# EAGLE design battery_brick_2.12 (EAGLE 7.2.0)
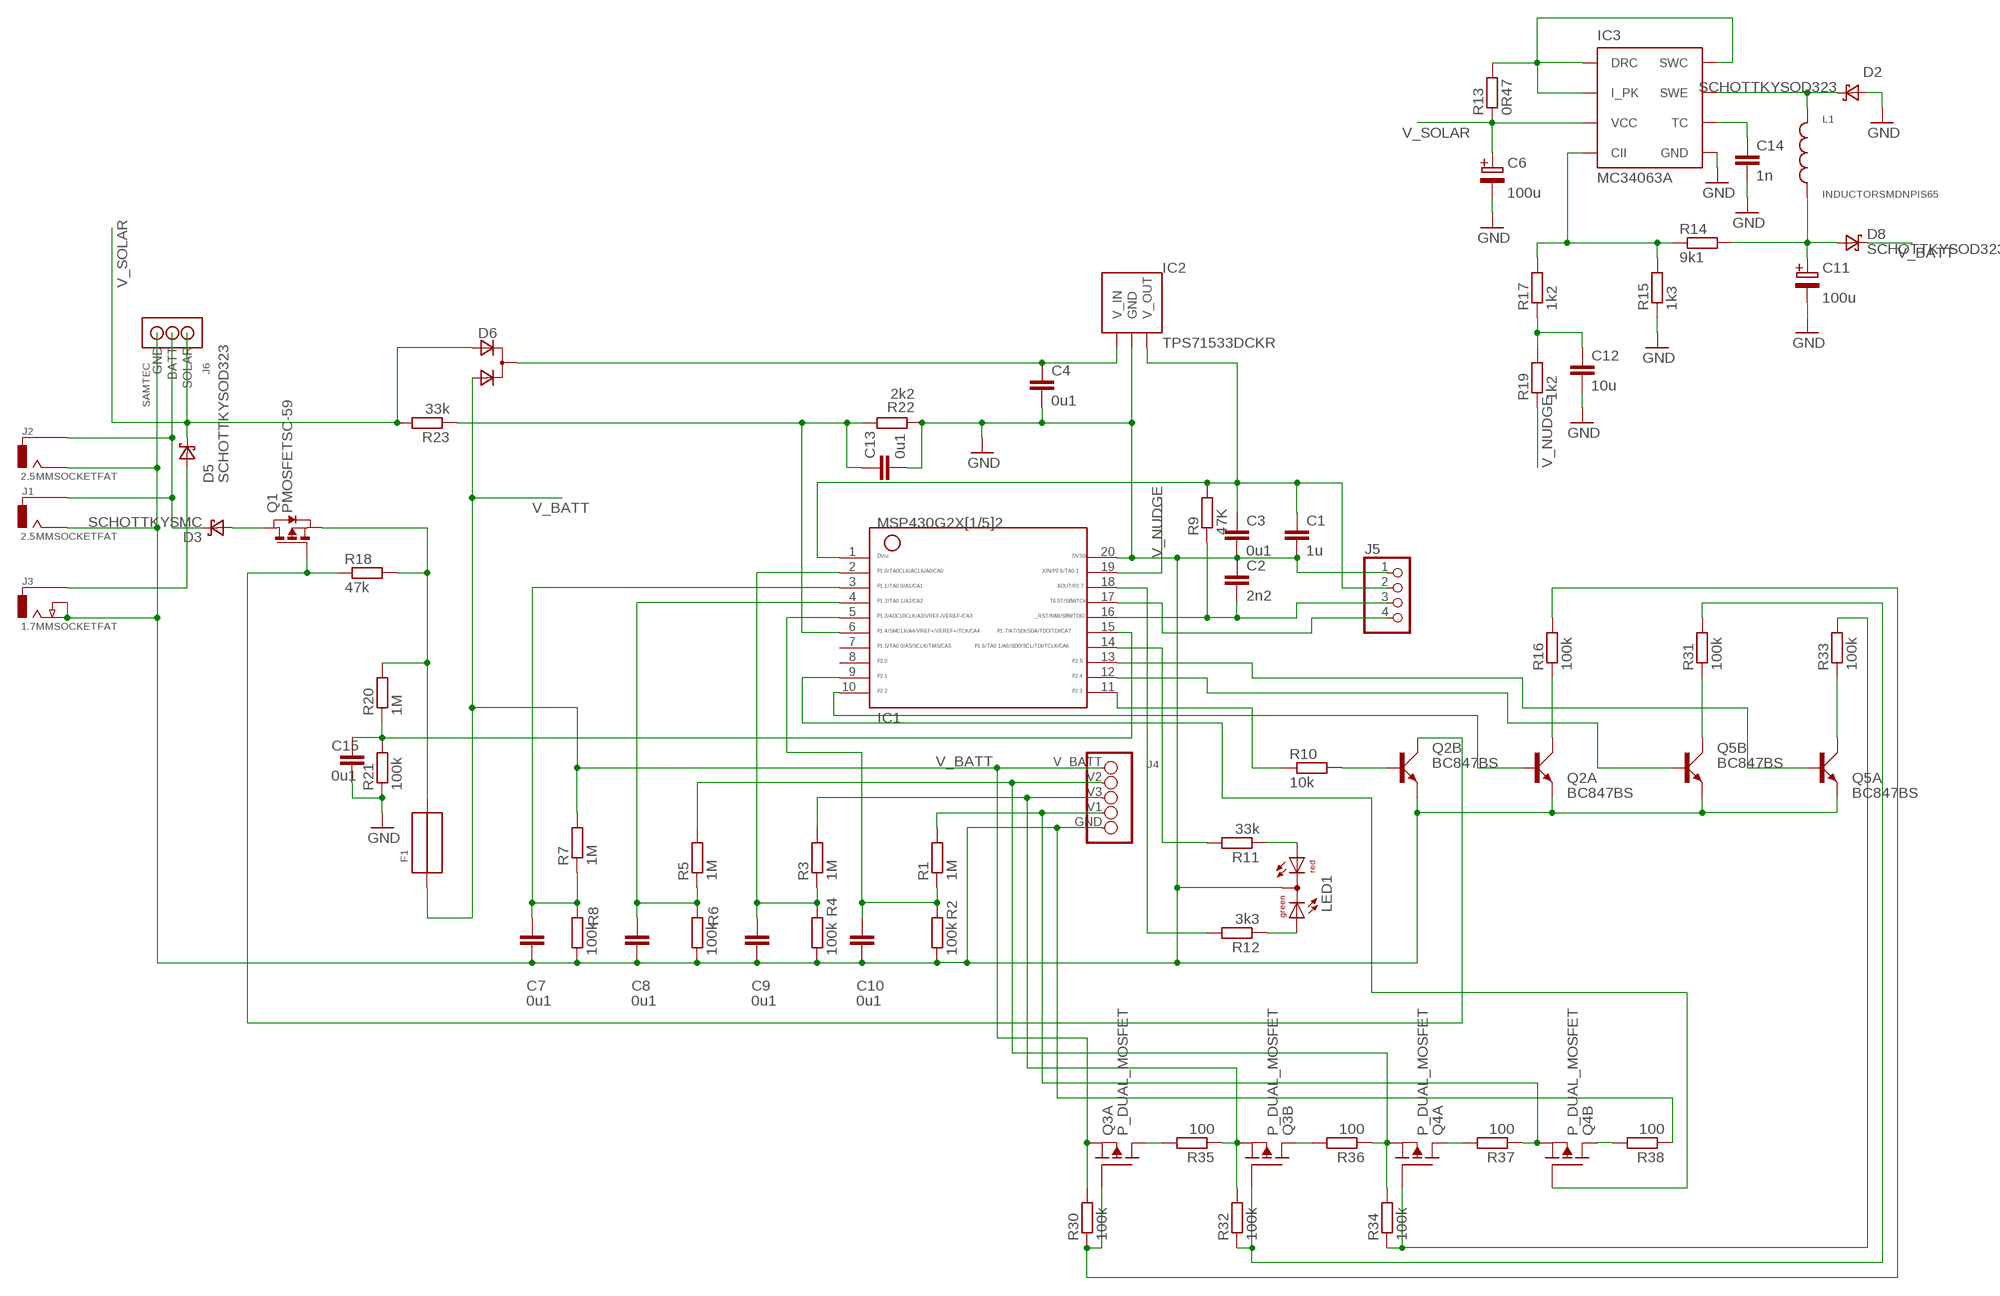
[diagram p0: schematic, sheet 1]

## Parts
C1  1u  C-EUC0603K  [C0603K]
C2  2n2  C-EUC0603K  [C0603K]
C3  0u1  C-EUC0603K  [C0603K]
C4  0u1  C-EUC0603  [C0603]
C6  100u  ELEC_CAP_CAN6VZH101  [CAPCANVZH101]
C7  0u1  C-EUC0603  [C0603]
C8  0u1  C-EUC0603  [C0603]
C9  0u1  C-EUC0603  [C0603]
C10  0u1  C-EUC0603  [C0603]
C11  100u  ELEC_CAP_CAN6VZH101  [CAPCANVZH101]
C12  10u  C-EUC2012  [C2012]
C13  0u1  C-EUC0603  [C0603]
C14  1n  C-EUC0603  [C0603]
C15  0u1  C-EUC0603  [C0603]
D2  SCHOTTKYSOD323  [SOD323]
D3  SCHOTTKYSMC  [SMC]
D5  SCHOTTKYSOD323  [SOD323]
D6  D_2ASOT323  [SOT323]
D8  SCHOTTKYSOD323  [SOD323]
F1  FUSE  [1812]
IC1  G2X[1/5]2---PW20  [PW20]
IC2  TPS71533DCKR  [SC70-5]
IC3  MC34063A  [SOIC8]
J1  2.5MMSOCKETFAT  [2.5MMSOCKET-OBLONGFAT]
J2  2.5MMSOCKETFAT  [2.5MMSOCKET-OBLONGFAT]
J3  1.7MMSOCKETFAT  [1.7MMSOCKET-OBLONGFAT]
J4  S5B-PH-K-S  [S5B-PH-K-S]
J5  PINHD-1X4  [1X04]
J6  SAMTEC  [SAMTEC]
L1  INDUCTORSMDNPIS65  [INDUCTOR_NPIS65]
LED1  DUOLED5MM  [DUOLED5MM]
Q1  PMOSFETSC-59  [SC-59]
Q2  BC847BS  [SOT363_PHILIPS]
Q3  P_DUAL_MOSFET  [SOT666]
Q4  P_DUAL_MOSFET  [SOT666]
Q5  BC847BS  [SOT363_PHILIPS]
R1  1M  R-EU_R0805  [R0805]
R2  100k  R-EU_R0805  [R0805]
R3  1M  R-EU_R0805  [R0805]
R4  100k  R-EU_R0805  [R0805]
R5  1M  R-EU_R0805  [R0805]
R6  100k  R-EU_R0805  [R0805]
R7  1M  R-EU_R0805  [R0805]
R8  100k  R-EU_R0805  [R0805]
R9  47K  R-EU_R0603  [R0603]
R10  10k  R-EU_R0603  [R0603]
R11  33k  R-EU_R0603  [R0603]
R12  3k3  R-EU_R0603  [R0603]
R13  0R47  R-EU_R1206  [R1206]
R14  9k1  R-EU_R0603  [R0603]
R15  1k3  R-EU_R0603  [R0603]
R16  100k  R-EU_R0603  [R0603]
R17  1k2  R-EU_R0603  [R0603]
R18  47k  R-EU_R0603  [R0603]
R19  1k2  R-EU_R0603  [R0603]
R20  1M  R-EU_R0603  [R0603]
R21  100k  R-EU_R0603  [R0603]
R22  2k2  R-EU_R0603  [R0603]
R23  33k  R-EU_R0603  [R0603]
R30  100k  R-EU_R0603  [R0603]
R31  100k  R-EU_R0603  [R0603]
R32  100k  R-EU_R0603  [R0603]
R33  100k  R-EU_R0603  [R0603]
R34  100k  R-EU_R0603  [R0603]
R35  100  R-EU_M1206  [M1206]
R36  100  R-EU_M1206  [M1206]
R37  100  R-EU_M1206  [M1206]
R38  100  R-EU_M1206  [M1206]

## Nets
GND: C1.2 C2.1 C3.2 C4.2 C6.-VE C7.2 C8.2 C9.2 C10.2 C11.-VE C12.2 C13.2 C14.2 C15.2 D2.ANODE IC1.20 IC2.GND IC3.GND J1.-VE J2.-VE J3.-VE J3.P$3 J4.GND J5.1 J6.GND LED1.K(C) Q2.1(A:E) Q2.4(B:E) Q5.1(A:E) Q5.4(B:E) R2.1 R4.1 R6.1 R8.1 R15.1 R21.1 R22.1 R38.1
N$1: IC1.17 J5.4
N$2: C10.1 IC1.5 R1.1 R2.2
N$3: F1.2 Q1.S R18.2 R20.2
N$4: C9.1 IC1.2 R3.1 R4.2
N$5: D3.CATHODE J1.+VE J2.+VE J6.BATT
N$6: C8.1 IC1.4 R5.1 R6.2
N$7: C7.1 IC1.3 R7.1 R8.2
N$8: C15.1 IC1.15 R20.1 R21.2
N$9: Q2.5(B:B) R10.2
N$10: IC1.14 R11.2
N$11: J4.V1 Q4.4(B:S) R1.2 R37.1
N$12: D5.ANODE J3.+VE
N$13: LED1.AG R12.1
N$14: LED1.AR R11.1
N$15: J4.V3 Q3.4(B:S) R3.2 R32.2 R35.1
N$16: J4.V2 Q4.1(A:S) R5.2 R34.2 R36.1
N$17: IC3.DRC IC3.I_PK IC3.SWC R13.2
N$19: D3.ANODE Q1.D
N$20: Q1.G Q2.3(B:C) R18.1
N$21: IC1.18 R12.2
N$22: IC3.CII R14.1 R15.2 R17.2
N$23: D2.CATHODE IC3.SWE L1.P$1
N$24: C13.1 IC1.6 R22.2 R23.1
N$25: C12.1 R17.1 R19.2
N$29: C11.+VE(P$1+) D8.ANODE L1.P$2 R14.2
N$30: C14.1 IC3.TC
N$32: Q3.6(A:D) R35.2
N$34: Q5.3(B:C) R31.1
N$38: IC1.9 Q4.5(B:G)
N$40: C2.2 IC1.16 J5.3 R9.1
N$44: Q3.2(A:G) R16.2 R30.1
N$45: Q3.5(B:G) R31.2 R32.1
N$48: Q4.2(A:G) R33.2 R34.1
N$49: Q5.6(A:C) R33.1
N$50: Q2.6(A:C) R16.1
N$51: Q4.3(B:D) R38.2
N$52: IC1.11 R10.1
N$53: IC1.10 Q2.2(A:B)
N$54: IC1.12 Q5.5(B:B)
N$55: IC1.13 Q5.2(A:B)
N$56: Q3.3(B:D) R36.2
N$57: Q4.6(A:D) R37.2
V_BATT: D6.3(A2) D8.CATHODE F1.1 J4.V_BATT Q3.1(A:S) R7.2 R30.2
V_NUDGE: IC1.19 R19.1
V_REGIN: C4.1 D6.1(C) IC2.IN(V_IN)
V_SOLAR: C6.+VE(P$1+) D5.CATHODE D6.2(A1) IC3.VCC J6.SOLAR R13.1 R23.2
VCC: C1.1 C3.1 IC1.1 IC2.OUT(V_OUT) J5.2 R9.2
Unconnected: IC1.7 IC1.8

## Library data of the parts
C1-C4 C7-C10 C12-C15 = rcl:C-EU: CAPACITOR, European symbol
C6 C11 = mylib:ELEC_CAP_CAN6
D2 D5 D8 = mylib:SCHOTTKY: DIODE; OC_FARNELL: 8737991
D3 = mylib:SCHOTTKY: DIODE
D6 = zetex:D_2A: Dual DIODE; OC_FARNELL: unknown; OC_NEWARK: unknown
F1 = mylib:FUSE
IC1 = TI_MSP430_v16:G2X[1/5]2---PW20: MSP430G2X[1/5]2 MSP430G2x52, MSP430G2x12 TSSOP (PW) 20 Pin Package http://focus.ti.com/docs/prod/folders/print/msp430g2452.html
IC2 = mylib:TPS71533DCKR
IC3 = mylib:MC34063A; OC_FARNELL: 1053582
J1 J2 = mylib:2.5MMSOCKET
J3 = mylib:1.7MMSOCKET
J4 = mylib:S5B-PH-K-S
J5 = pinhead:PINHD-1X4: PIN HEADER
J6 = mylib:SAMTEC
L1 = mylib:INDUCTORSMD
LED1 = mylib:DUOLED5MM: DUO LED 2 colors, 5 mm, round
Q1 = mylib:PMOSFET: MOS FET
Q2 Q5 = transistor-small-signal:BC847BS: NPN general purpose double transistor Source: http://www.farnell.com/datasheets/2466.pdf
Q3 Q4 = mylib:P_DUAL_MOSFET: Dual N-Channel 30-V (D-S) MOSFET Source: http://www.vishay.com/docs/71053/71053.pdf
R1 R3 R5 R7 R9 R10 R13-R15 R17-R20 R35-R38 = rcl:R-EU_: RESISTOR, European symbol
R2 R4 R6 R8 R11 R12 R16 R21-R23 R30-R34 = resistor:R-EU_: RESISTOR, European symbol

## Board
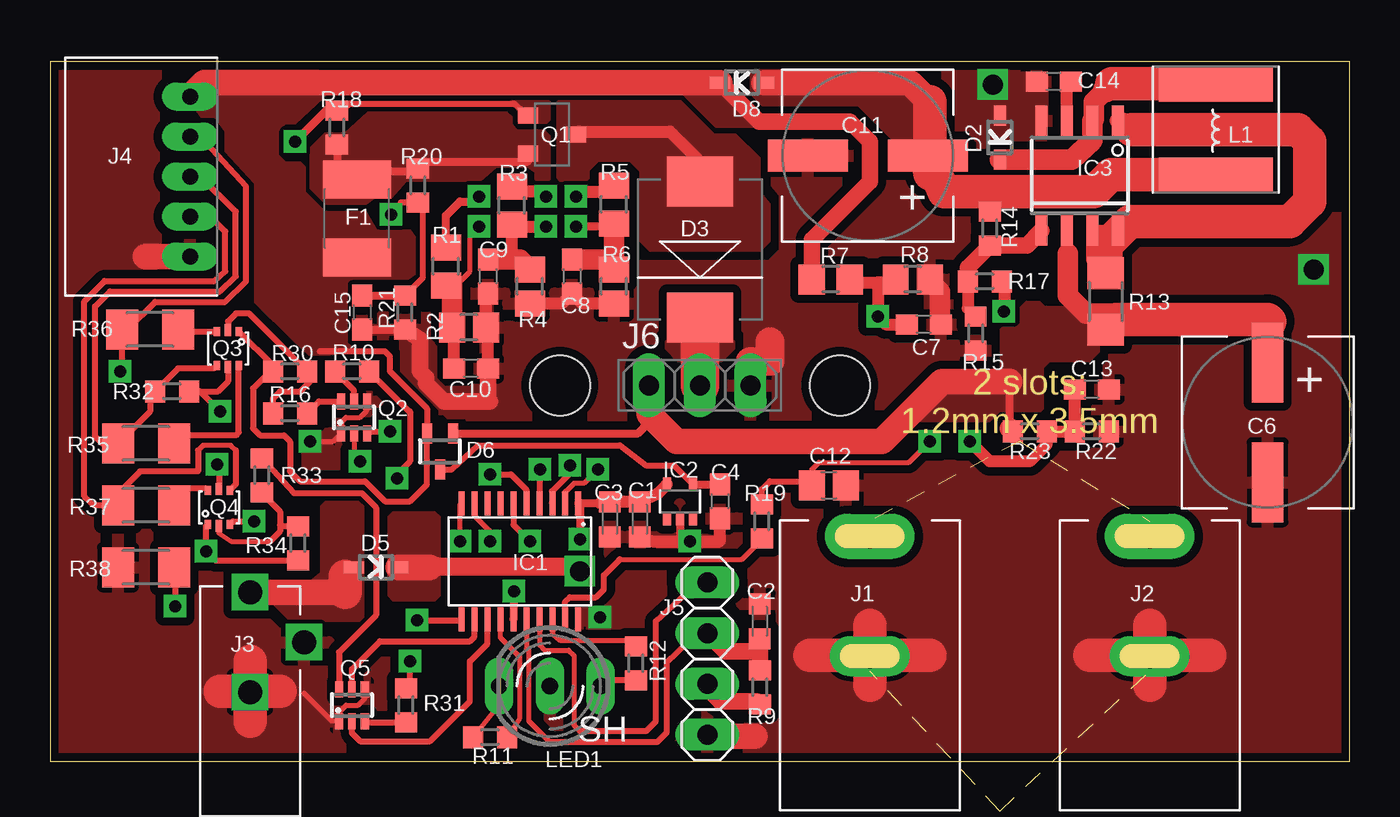
[diagram p1: board, top side]
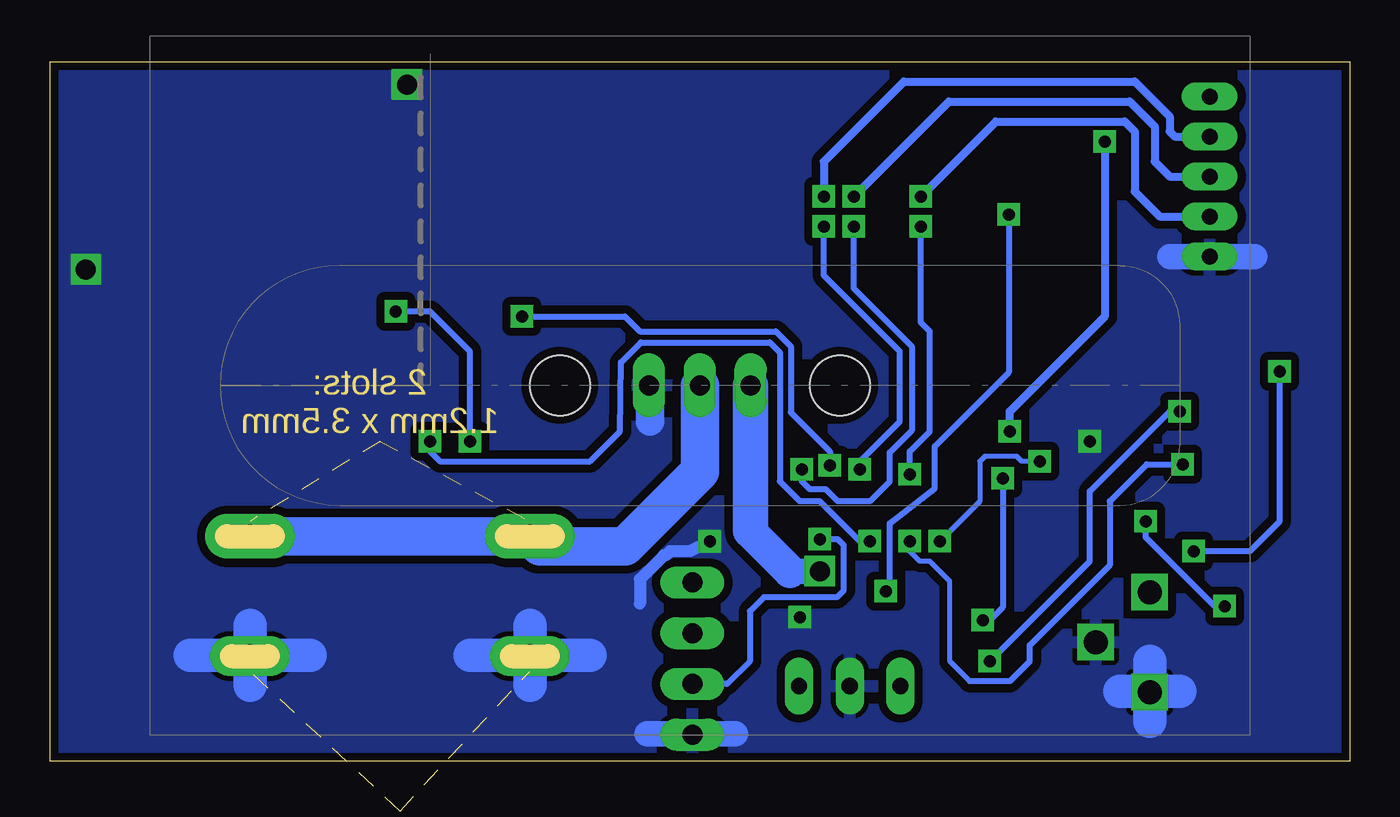
[diagram p2: board, bottom side, seen from below]

Size 65 x 35 mm. Coordinates in mm from the lower left corner, seen from the top.
Outline: 0,0 65,0 65,35 0,35 0,0
Copper layers (1*16): Top 0.035mm / dielectric 1.5mm / Bottom 0.035mm
Design rules "myRules": minimum track width 8mil, minimum drill 20mil, track to track 8mil, track to pad 8mil, pad to pad 9mil, via to via 8mil, smd to smd 8mil, copper to edge 10mil, drill to drill 8mil, minimum pad ring 12mil, minimum via ring 10mil, stop-mask expansion 3mil, vias tented up to drill 40mil, thermal gap 10mil
Holes 3 mm at 25.5,18.8 39.5,18.8
tKeepout: area 22.8,16.1 to 28.2,21.6; area 36.8,16.1 to 42.2,21.6
Milling: area 73.5,2.7 to 75,3.3; area 92,2.7 to 93.5,3.3; area 83.5,3.4 to 83.5,3.4; area 101.2,10 to 101.8,11.5; area 101.2,18.5 to 101.8,20; area 101.1,15 to 101.1,15; 34 lines

### Footprints (pad centres in the part's own frame; a part is rotated, then mirrored left to right if it is on the bottom)
C0603K = smd 1.05 x 1.08: 1 -0.875,0; 2 0.875,0
C0603 = smd 1.1 x 1: 1 -0.85,0; 2 0.85,0
CAPCANVZH101 = smd 1.6 x 4: +VE 0,3; -VE 0,-3
C2012 = smd 1.3 x 1.5: 1 -0.85,0; 2 0.85,0
SOD323 = smd 1 x 0.6: ANODE 1.1,0; CATHODE -1.1,0
SMC = smd 2.5 x 3.3: ANODE 0,0; CATHODE 6.8,0
SOT323 = smd 0.5 x 1: 1 0,0.9; 2 -0.65,-0.9; 3 0.65,-0.9
1812 = smd 1.9 x 3.4: 1 -1.95,0; 2 1.95,0
PW20 = smd 0.3 x 1.2: 1 -2.925,-2.9; 2 -2.275,-2.9; 3 -1.625,-2.9; 4 -0.975,-2.9; 5 -0.325,-2.9; 6 0.325,-2.9; 7 0.975,-2.9; 8 1.625,-2.9; 9 2.275,-2.9; 10 2.925,-2.9; 11 2.925,2.9; 12 2.275,2.9; 13 1.625,2.9; 14 0.975,2.9; 15 0.325,2.9; 16 -0.325,2.9; 17 -0.975,2.9; 18 -1.625,2.9; 19 -2.275,2.9; 20 -2.925,2.9
SC70-5 = smd 0.4 x 0.7: FB/NC -0.65,-0.85; GND 0,-0.85; IN 0.65,0.85; NC 0.65,-0.85; OUT -0.65,0.85
SOIC8 = smd 1.5 x 0.6: CII 0.21,-1.905; DRC 0.21,1.905; GND -5.29,-1.905; I_PK 0.21,0.635; SWC -5.29,1.905; SWE -5.29,0.635; TC -5.29,-0.635; VCC 0.21,-0.635
2.5MMSOCKET-OBLONGFAT = drill 1.2 pad 2.25 long: +VE 0,0 | drill 1.2 pad 2 long: -VE 0,-6
1.7MMSOCKET-OBLONGFAT = drill 1.2 square: +VE 0,0; -VE 0,-5; P$3 2.7,-2.5
S5B-PH-K-S = drill 0.8 long: GND 0,0; V1 0,2; V2 0,6; V3 0,4; V_BATT 0,8
1X04 = drill 1 long: 1 -3.81,0; 2 -1.27,0; 3 1.27,0; 4 3.81,0
SAMTEC = drill 1 long: BATT 0,0; GND 2.54,0; SOLAR -2.54,0
INDUCTOR_NPIS65 = smd 5.7 x 1.7: P$1 0,2.25; P$2 0,-2.25
DUOLED5MM = drill 0.813 long: AG -2.54,0; AR 2.54,0; K 0,0
SC-59 = smd 0.8 x 1: D 0.95,2.4; G 0,0; S 1.9,0
SOT363_PHILIPS = smd 0.4 x 0.8: 1 -0.65,-0.8; 2 0,-0.8; 3 0.65,-0.8; 4 0.65,0.8; 5 0,0.8; 6 -0.65,0.8
SOT666 = smd 0.45 x 0.325: 1 -0.85,0.54; 3 -0.85,-0.54; 4 0.85,-0.54; 6 0.85,0.54 | smd 0.6 x 0.325: 2 -0.925,0; 5 0.925,0
R0805 = smd 1.3 x 1.5: 1 -0.95,0; 2 0.95,0
R0805' = smd 1.3 x 1.5: 1 -0.85,0; 2 0.85,0
R0603 = smd 1 x 1.1: 1 -0.85,0; 2 0.85,0
R1206 = smd 1.6 x 1.803: 1 -1.422,0; 2 1.422,0
M1206 = smd 1.6 x 2: 1 -1.4,0; 2 1.4,0

### Placement (x,y rotation side)
C1  29.5,12.1 270 top
C2  35.5,7 270 top
C3  28,12.1 270 top
C4  33.5,13 270 top
C6  60.9,16.95 0 top
C7  43.7,21.85 0 top
C8  26.1,24.25 270 top
C9  21.9,24.25 270 top
C10  21.05,19.65 0 top
C11  40.9,30.3 270 top
C12  38.95,13.8 0 top
C13  52.1,18.6 0 top
C14  50.2,34 180 top
C15  15.6,22.45 270 top
D2  47.5,31.2 90 top
D3  32.5,29 270 top
D5  16.3,9.7 180 top
D6  19.5,15.5 180 top
D8  34.6,33.95 0 top
F1  15.35,27.15 90 top
IC1  23.5,10 180 top
IC2  31.5,13 0 top
IC3  51.5,26.75 270 top
J1  41,11.25 0 top
J2  55,11.25 0 top
J3  10,8.45 0 top
J4  7,25.25 0 top
J5  32.88,5.12 90 top
J6  32.5,18.8 0 top
L1  58.3,31.6 0 top
LED1  25,3.75 180 top
Q1  23.9,32.3 270 top
Q2  15.2,17.2 0 top
Q3  8.9,20.65 270 top
Q4  8.45,12.7 90 top
Q5  15.1,2.8 0 top
R1  19.8,24.75 90 top
R2  100k  [R0805']  20.95,21.7 180 top
R3  23.1,27.8 90 top
R4  100k  [R0805']  24,23.75 90 top
R5  28.2,27.85 90 top
R6  100k  [R0805']  28.2,23.75 90 top
R7  39.05,24.1 180 top
R8  100k  [R0805']  43.15,24.1 180 top
R9  35.5,3.7 270 top
R10  15.1,19.5 180 top
R11  22,1.2 0 top
R12  29.3,4.9 90 top
R13  52.8,23 90 top
R14  47,26.65 90 top
R15  46.3,21.4 90 top
R16  12,17.4 180 top
R17  46.75,24 180 top
R18  14.35,31.7 270 top
R19  35.6,12 90 top
R20  18.4,28.8 90 top
R21  17.75,22.45 90 top
R22  52.1,16.5 180 top
R23  49,16.5 180 top
R30  12,19.5 180 top
R31  17.8,2.8 90 top
R32  6.1,18.5 180 top
R33  10.6,14.3 270 top
R34  12.4,10.9 270 top
R35  4.8,15.9 0 top
R36  5,21.6 0 top
R37  4.8,12.8 0 top
R38  4.8,9.7 0 top

### Tracks (layer width: path | path; a pad name or v marks a point on that pad's centre or on a via)
GND  (via drill 0.6, 1)
  Top 0.254: v13,16 14.15,16 Q2.1 14.55,16.55 14.6,16.6 14.6,17 14.8,17.2 15.5,17.2 15.85,17.55 Q2.4 | Q5.4 15.75,3.15 15.4,2.8 14.8,2.8 14.5,2.5 14.5,2.05 Q5.1 14.1,2 12.7,3.4
  Top 0.406: IC2.GND 31.5,11 | C15.2 R21.1
  Top 0.61: R6.1 26.6,22.9 C8.2 25.6,22.9 R4.1 | C1.2 30.12,11 31.5,11 v32,11 33.5,11 C4.2 | C10.2 21.9,21.6 R2.1 21.8,23.3 C9.2
  Top 0.813: R21.1 18.5,21.1 18.5,19.5 18.8,19.2 18.8,18.9 19.7,18 22,18 21.9,18.1 C10.2
  Top 1.016: R8.1 44,24 44.5,23.5 44.5,21.9 C7.2
  Top 1.27: J4.GND 4.75,25.25 | 32.75,1.25 35.25,1.25
  Top 1.422: 35,20 36,20 36,21
  Top 1.676: 10,3.5 10,5 | 10,2 10,3.5 | 10,3.5 11.5,3.5 | 10,3.5 8.5,3.5 | 41,5.3 41,6.8 | 41,3.8 41,5.3 | 41,5.3 44,5.3 | 41,5.3 38,5.3 | 55,5.3 55,6.8 | 55,3.8 55,5.3 | 55,5.3 58,5.3 | 55,5.3 52,5.3
  Bottom 0.305: J6.GND 35,18.76 35,18.75
  Bottom 0.61: v32,11 33,10.5 34,10.5 34.2,10.3 34.3,10.3 35.5,9.1 C2.1
  Bottom 1.27: 9,25.25 J4.GND 4.75,25.25 | 30.72,1.36 35.14,1.36
  Bottom 1.422: 35,18.75 35,17
  Bottom 1.676: 10,3.5 10,5 | 10,2 10,3.5 | 10,3.5 11.5,3.5 | 10,3.5 8.5,3.5 | 41,5.3 41,6.8 | 41,3.8 41,5.3 | 41,5.3 44,5.3 | 41,5.3 38,5.3 | 55,5.3 55,6.8 | 55,3.8 55,5.3 | 55,5.3 58,5.3 | 55,5.3 52,5.3
  other vias: 27.5,7.2 47.15,33.85 63.2,24.6
  pour Top (isolate 0.406, rank 4): 0,0 65,0 65,35 0,35
  pour Bottom (isolate 0.406, rank 4): 0,0 65,0 65,35 0,35
  pour Top (no thermals): 26.45,7.7 27.7,7.7 27.85,7.55 27.85,6.9 27.7,6.75 26.5,6.75 26.4,6.85 26.4,7.65
  pour Top (no thermals): 17.5,21.35 17.5,19.5 19.85,17.15 22.6,17.15 22.6,18.6 22.45,18.75 19.75,18.75 19.35,19.15 19.35,20.8 18.3,21.85 17.85,21.85 17.5,21.5
  pour Top (no thermals): 49.3,31.25 47.25,31.25 46.8,31 46.32,31 46,31.32 46,34.2 46.4,34.5 49,34.5 49.9,34 49.9,31.95
N$1
  Top 0.254: 26.5,1.5 26.2,1.8 26.2,5.3 25.95,5.55 24.73,5.55 24.48,5.8 IC1.17
  Top 0.305: J5.4 32.44,8.94 30.3,7 30.3,2 29.8,1.5 26.5,1.5
N$2  (via drill 0.6)
  Top 0.254: R1.1 20.3,23.8 21,24.5 21,26.3 v21.45,26.75
  Top 0.305: v22,14.35 23.05,14.35 23.82,13.57 IC1.5
  Top 0.61: C10.1 20.2,21.6 R2.2
  Top 1.016: R2.2 20.1,23.8 R1.1
  Bottom 0.305: v22,14.35 22,15.5 21,16.5 21,21.5 21.45,21.95 v21.45,26.75
N$3
  Top 0.406: R18.2 14.35,29.2 F1.2 | F1.2 15.35,29.15 | F1.2 16.2,29.2 16.5,29.5 18.25,29.5 R20.2 18.75,30 23.9,30 Q1.S
  pour Top (no thermals): 17.05,28.15 16.2,28.15 15.8,27.85 13.8,27.85 13,28.65 13,30.7 13.75,31.45 14.75,31.45 15.9,32.5 22.85,32.5 23.1,32.25 23.1,31.85 23.35,31.6 24.7,31.6 25,31.3 25,29.1 24.9,29 24.35,29 24.25,29.1 24.25,29.45 23.9,29.7 22.3,29.7 21.5,29 17.8,29
N$4  (via drill 0.6)
  Top 0.254: v27.4,14.6 26.7,13.9 26.2,13.9 25.8,13.5 arc90 25.77,13.47 IC1.2
  Top 0.61: R4.2 23.1,25.5 R3.1 23.2,26.75 v24.8,26.75
  Top 1.016: R4.2 23.5,25.1 C9.1
  Bottom 0.305: v24.8,26.75 24.8,23.65 21.9,20.75 21.9,16.55 23,15.45 23,14 24,13 25.6,13 26.2,13.6 27,13.6 27.4,14 v27.4,14.6
N$5
  Top 1.93: J6.BATT D3.CATHODE
  Bottom 1.93: J6.BATT 32.5,14.5 36.25,10.75 40.5,10.75 40.5,11.25 J1.+VE J2.+VE
  pour Top (no thermals): 30.75,21 30.75,20.64 31.39,20 33,20 33.62,20 34.25,20.64 34.25,21 34,21.25 31,21.25
N$6  (via drill 0.6)
  Top 0.254: R5.1 28.05,26.75
  Top 0.305: IC1.4 24.5,12.93 v24.5,14.6
  Top 0.406: 28.05,26.75 v26.3,26.75
  Top 1.016: R5.1 R6.2 27.7,25.1 C8.1
  Bottom 0.305: v26.3,26.75 26.3,24.3 22.5,20.5 22.5,17 24.5,15 v24.5,14.6
N$7  (via drill 0.6)
  Top 0.254: R7.1 40.5,23.95
  Top 0.305: v26,14.8 26,14.4 25.1,13.5 25.1,12.93 IC1.3
  Top 0.61: 40.5,23.95 41.4,23.95 | R8.2 42.15,23.95 41.4,23.95 | 41.4,23.95 v41.4,22.25 41.8,21.85 C7.1
  Bottom 0.305: v41.4,22.25 36.25,22.25 35.5,21.5 28.7,21.5 27.95,20.75 27.95,17.45 26,15.5 v26,14.8
N$8  (via drill 0.6)
  Top 0.305: R21.2 18.65,24.2 18.65,27.95 R20.1 17.55,27.95 v17.05,27.35
  Top 0.406: IC1.15 23.2,7.12 v23.2,8.5 | C15.1 R21.2
  Bottom 0.305: v23.2,8.5 23,8.7 23,11.9 20.75,13.65 20.75,15.75 17.05,19.45 v17.05,27.35
N$9
  Top 0.305: Q2.5 15.2,18.55 R10.2
N$10
  Top 0.24: R11.2 23.5,2.14 23.5,4.99 23.5,5 23.5,5.2 22.52,6.17 IC1.14
  Top 0.254: IC1.14 22.5,7.1
N$11  (via drill 0.6)
  Top 0.254: 7.4,15.55 7.65,15.8 9.05,15.8 9.3,15.55
  Top 0.305: 7.4,15.55 7.4,14.5 4.5,14.5 3.4,13.4 R37.1 2.2,12.8 1.72,13.25 1.72,23 2.73,24.02 8.23,24.02 8.77,24.5 8.77,26.5 8,27.25 J4.V1 | Q4.4 9.3,13.86 9.3,15.55
  Top 0.406: R1.2 19.8,27.3 20.5,28 21.2,28 v21.45,28.25
  Bottom 0.406: v21.45,28.25 17.7,32 11.25,32 10.75,31.5 10.75,28.5 9.5,27.25 J4.V1
N$12
  Top 0.254: 14.75,9.25 15.2,9.25 D5.ANODE
  Top 1.27: J3.+VE 14.75,8.45
  Top 1.676: 14.75,8.45 14.75,9.25
  pour Top (no thermals): 15.7,7.2 15.7,12.75 15.45,13 13.75,13 13.5,12.75 13.5,9.41 12.96,8.96 12.5,8 11,8 12,7 15.5,7
N$13
  Top 0.305: R12.1 27.59,4.05 LED1.AG
N$14
  Top 0.254: LED1.AR 22.46,2.81 R11.1
N$15  (via drill 0.6)
  Top 0.305: Q3.4 8.21,19.65 6.4,19.65 R32.2 5,18.25 5,17.5 R35.1 2.6,15.9 2.25,16.25 2.25,22.75 3,23.5 8.5,23.5 9.29,24.25 9.29,27.5 7.5,29.25 J4.V3
  Top 0.61: v24.8,28.25 24.55,28.5 23.5,28.5 23.25,28.75 R3.2
  Bottom 0.406: v24.8,28.25 20.05,33 11,33 9.75,31.75 9.75,30 9,29.25 J4.V3
N$16  (via drill 0.6)
  Top 0.305: v3.5,19.5 3.6,19.6 R36.1 3.85,21.6 5.25,22.97 8.75,22.97 9.8,24 9.8,28.75 7.5,31.25 J4.V2 | Q4.1 7.8,11.74 v7.8,10.5 8.25,10.05 R34.2
  Top 0.61: v26.3,28.25 26.55,28.5 28,28.5 28.2,28.7 R5.2
  Bottom 0.305: v3.5,19.5 3.5,12 5,10.5 v7.8,10.5
  Bottom 0.406: v26.3,28.25 26.3,30 22.3,34 10.75,34 9,32.25 9,31.5 8.75,31.25 J4.V2
N$17
  Top 0.61: IC3.DRC IC3.I_PK 52.13,25.09 R13.2
  Top 0.813: 54.1,31.6 53.66,32.04 IC3.SWC
  Top 1.27: R13.2 53,24.62 53,26
  Top 1.676: 53,26 54,27 62,27 63,28 63,31 62.4,31.6 54.1,31.6
N$19
  Top 0.61: D3.ANODE 32.5,30 31,31.5 26.45,31.5 Q1.D
  pour Top (no thermals): 26.8,29 25.52,29 25.35,29.17 25.35,33 25.5,33.15 31.45,33.15 33.2,31.4 34.28,31.4 35.5,30.18 35.5,28.5 36,27.9 36,26 35.5,25.5 30,25.5 29.5,26 29.5,29.5 29,30 27.4,30 26.95,29.55 26.95,29.15
N$20  (via drill 0.6)
  Top 0.305: Q2.3 15.95,16.5 v17,16.5 | R18.1 14.65,32.65 15,32.9 23.2,32.9 Q1.G
  Top 0.406: R18.1 13.8,32.55 v12.25,31
  Bottom 0.406: v17,16.5 17,17.5 12.25,22.25 v12.25,31
  pour Top (no thermals): 23.5,31.9 23.4,32 23.4,32.8 22.9,33 23.1,33.1 24.9,33.1 25,33 25,32.05 24.85,31.9
N$21
  Top 0.254: R12.2 28.8,6.05 25.5,6.05 25.12,6.38 IC1.18
  Top 0.305: R12.2 29.05,6
N$22
  Top 0.61: R17.2 45.9,22.65 R15.2
  Top 0.813: R17.2 45.9,24.7 R14.1 48.85,25.8 IC3.CII
N$23
  Top 1.016: 52.8,33.6 52.2,33 52.2,32.1 IC3.SWE 52.13,31.04 51.1,30.1 D2.CATHODE
  Top 1.27: 52.8,33.6 53.1,33.9
  Top 1.676: 53.1,33.9 58.25,33.9 L1.P$1
N$24  (via drill 0.6)
  Top 0.254: R23.1 49.85,15.85
  Top 0.305: IC1.6 23.18,11.82 v24,11
  Top 0.61: R23.1 R22.2 C13.1 | 49.85,15.85 49,15 47,15 v46,16
  Bottom 0.305: v24,11 24.5,11 26.5,13 27.5,13 28.5,14 28.5,20.45 29,20.95 35.45,20.95 36.45,19.95 36.5,16.5 38,15 45.5,15 46,15.5 v46,16
N$25  (via drill 0.6)
  Top 0.254: v44,16 42.95,14.95 38.45,14.95 38.1,14.6 C12.1
  Top 0.305: R19.2 35.6,13.6 36,14 37.9,14 C12.1 38,13.9
  Top 0.61: R17.1 47.75,23.85 v47.7,22.5
  Bottom 0.305: v44,16 44,20.5 46,22.5 v47.7,22.5
N$29
  Top 0.305: 44,33 43.95,33
  Top 0.406: R14.2 47,28.5
  Top 1.27: 43.95,33 43,33.95 D8.ANODE
  Top 1.676: L1.P$2 53.05,29.35 52.2,28.5 47,28.5 44.7,28.5 C11.+VE 44,29.4 44,33
  pour Top (no thermals): 35,34.4 35,33.4 35.6,32.8 40.4,32.8 42.4,30.8 43.4,30.8 43.2,34.5 43,34.6 35.2,34.6
N$30
  Top 0.61: IC3.TC 50.87,33.81 C14.1
N$32
  Top 0.305: R35.2 6.6,16.3 9.3,16.3 9.44,16.44 Q3.6
N$34
  Top 0.305: Q5.3 15.8,1.95 R31.1
N$38  (via drill 0.6)
  Top 0.254: v22,11 22,11.5 21.23,12.28 IC1.9
  Top 0.305: v8.35,14.85 8.45,14.75 Q4.5
  Bottom 0.254: 19,4 20,5 20,9 21,10 21.5,10 22,10.5 v22,11
  Bottom 0.305: v8.35,14.85 10.15,14.85 12,13 12,9.8 16,5.8 16,5 17,4 19,4
N$40
  Top 0.254: 25,0.95 23.95,2 23.95,5.5 23.82,5.63 IC1.16
  Top 0.305: J5.3 32.4,6.39 30.85,4.95 30.85,1.45 30.35,0.95 25,0.95
  Top 0.813: C2.2 35.5,5.5 | 35.5,5.5 R9.1 | J5.3 33.77,5.5 35.5,5.5
N$44
  Top 0.305: R16.2 11.15,18.15 11.5,18.5 12.5,18.5 13,19 13,19.35 R30.1 9.95,22.4 9.3,22.4 8.9,22 Q3.2
N$45  (via drill 0.6)
  Top 0.305: v8.5,17.5 7.5,18.5 R32.1 8.4,18.5 8.9,19 Q3.5 | R31.2 18,3.85 v18,5
  Bottom 0.305: v18,5 13,10 13,13.5 9,17.5 v8.5,17.5
N$48
  Top 0.254: R33.2 10.6,13.4 | 11.55,11.75 11.5,11.8 | Q4.2 8.45,11.4 9.05,11 11,11
  Top 0.305: 10.6,13.4 11.5,12.5 11.5,11.8 11.5,11.5 11,11 | R34.1 11.55,11.75
N$49
  Top 0.305: Q5.6 14.45,5.45 16.3,7.3 16.3,12.7 15.6,13.4 12.2,13.4 R33.1
N$50
  Top 0.305: R16.1 13.45,18 Q2.6
N$51  (via drill 0.6)
  Top 0.305: R38.2 6.2,9 6.25,9 v6.25,7.75 | Q4.3 9.14,12 v10.2,12
  Bottom 0.305: v6.25,7.75 6.75,7.75 10.2,11.2 v10.2,12
N$52  (via drill 0.6)
  Top 0.305: v18.35,7.05 20.52,7.05 IC1.11 | 16,19.5 R10.1 17.95,17.5 18,17.5 18,15 17.35,14.35 v17.35,14.15
  Bottom 0.305: v17.35,14.15 17.35,7.7 18,7.05 v18.35,7.05
N$53  (via drill 0.6)
  Top 0.254: Q2.2 15.2,15.3 v15.5,15 | v20.5,11 20.5,12.82 IC1.10
  Bottom 0.254: v15.5,15 16.4,15 16.65,15.25 18.25,15.25 18.5,15 18.5,13 v20.5,11
N$54
  Top 0.305: Q5.5 15.1,4.6 16.5,6 21,6 21.23,6.22 IC1.12
N$55
  Top 0.305: IC1.13 21.88,5.88 21,5 21,3 19,1 15.5,1 15.1,1.4 Q5.2
N$56
  Top 0.305: R36.2 6.5,21.5 Q3.3
N$57
  Top 0.254: 6.2,13.35 6.2,13.4 6.45,13.65
  Top 0.305: R37.2 6.2,13.35 | Q4.6 7.81,13.65 6.45,13.65
V_BATT
  Top 0.305: 11,19.65 R30.2 | R30.2 11,19.5 10.15,18.65 10.15,16.65 10.5,16.3 11.7,16.3 12,16 12,14.5 12.5,14 15.75,14 16.75,13 18,13 18.85,13.85 D6.3 18.85,17.65 17,19.5 17,20.25 16.75,20.5 13.5,20.5 | Q3.1 11.15,19.79 R30.2
  Top 0.813: D8.CATHODE 35.45,32 40,32 41,31 41,29 38.1,26.1 R7.2
  Top 1.27: D8.CATHODE 7.7,33.95 J4.V_BATT
  pour Top (no thermals): 16.34,26.59 18.02,26.59 18.25,26.25 18.25,24.35 17.9,24.1 15.12,24.1 14.85,23.88 14.85,20.95 15.4,20.5 14,20.3 12.95,20.3 12.2,21 10.24,22.95 10.24,28.88 8.75,30.49 8.75,31.5 8.25,32.2 7.55,32.2 7,33 7,33.75 7.6,34.6 13.4,34.6 14,33.5 12.27,31.86 11.77,31.86 11.4,31.51 11.4,30.35 11.75,30 12.5,30 12.75,29.75 12.75,28.5 13.74,27.51 15.79,27.51
  pour Top (no thermals): 36.3,31.7 33.3,31.7 31.3,33.7 32,34.5 33.5,34.5
V_NUDGE
  Top 0.254: 28.45,10.1 28.5,10.1 34.6,10.1 35.6,11.1 R19.1
  Top 0.305: IC1.19 25.77,7.97 26,8.2 27.3,8.2 27.7,8.6 27.7,9.3 28.5,10.1
V_REGIN
  Top 0.305: D6.1 20.1,14.6 21.4,15.8 28.5,15.8 29.8,14.8 31.2,14.8 IC2.IN
  Top 0.406: IC2.IN C4.1
V_SOLAR  (via drill 1)
  Top 0.406: 48.02,16.64 48.02,18.98 | D6.2 29.4,16.4 29.96,16.96 J6.SOLAR
  Top 0.61: 50.9,25.4 50.87,25.43 IC3.VCC
  Top 0.9: 19,9.7 19.3,9.7 19.35,9.75 26.25,9.75 v26.5,9.5
  Top 1.016: 26.3,9.7 arc-90 v26.5,9.5 | 48.02,18.98 48,19 | R23.2 48.02,16.64 | 53.32,22.1 53.62,22.4 | 53.62,22.4 54,22.4 | 53.62,22.4 51.8,22.4 50.9,23.3 50.9,25.4 | 60.9,22.1 C6.+VE
  Top 1.27: D5.CATHODE 19,9.7 | 48,19 44.6,19 41.6,16 31.33,16 29.96,17.37 J6.SOLAR
  Top 1.422: R13.1 53.32,22.1
  Top 1.676: 61,22 60.9,22.1 53.32,22.1
  Bottom 1.27: v26.5,9.5 28,9.5
  Bottom 1.676: 28,9.5 30,11.5 29.96,11.54
  Bottom 1.778: 29.96,11.54 J6.SOLAR
  pour Top (no thermals): 19.5,12.25 19.5,8.25 19.25,8 17.15,8 16.9,8.25 16.9,12.25 17.15,12.5 19.25,12.5
  pour Top (no thermals): 43,17 47,17 47.5,17.5 49.55,17.5 49.7,17.65 49.7,19.7 50,20 52,20 52.5,20.5 52.5,22 51.75,22.75 49.75,22.75 49.5,23 48.82,23 48.5,22.68 48.5,21.9 48.35,21.75 47.65,21.75 47.5,21.6 47.5,19.5 45.5,19.5
VCC  (via drill 0.6)
  Top 0.406: 27.52,12.9 IC1.1 26.5,12.82 v26.5,11.1
  Top 0.61: IC2.OUT 30.38,13.38 C1.1 C3.1 27.52,12.9
  Top 0.813: R9.2 35.35,3 33.5,3 32.88,3.62 J5.2
  Bottom 0.305: 32.24,3.85 J5.2 31.14,3.85 30,5 30,7.5 29.3,8.2 25.65,8.2 25.3,8.55 25.3,10.8 25.6,11.1 v26.5,11.1

### Text on the board
Milling: 4 routing traces on this board for connectors. / NOTE: All dimensions are to the outside edge / of the thick traces, not to their centrelines. / See image below for clarity. | 2 slots: / 1.2mm x 3.5mm | Height / (i.e. tool size) | Length | 2 slots: / 1.2mm x 3.0mm
OrgLBR: (c) Shamba Technologies / Nov-2015 / Rev: 2.12